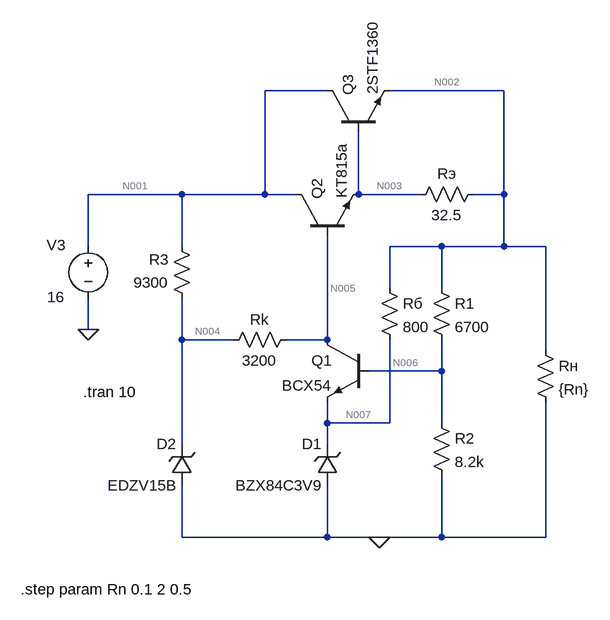
[diagram p0: schematic Компенсационный стабилизатор.asc]
Компенсационный стабилизатор.asc, the LTspice schematic file:
Version 4
SHEET 1 1044 680
WIRE 416 -128 320 -128
WIRE 688 -128 512 -128
WIRE 192 32 48 32
WIRE 320 32 320 -128
WIRE 320 32 192 32
WIRE 368 32 320 32
WIRE 464 32 464 -64
WIRE 560 32 464 32
WIRE 688 32 688 -128
WIRE 688 32 640 32
WIRE 48 112 48 32
WIRE 192 112 192 32
WIRE 592 112 512 112
WIRE 688 112 688 32
WIRE 688 112 592 112
WIRE 752 112 688 112
WIRE 512 176 512 112
WIRE 592 176 592 112
WIRE 48 240 48 192
WIRE 192 256 192 192
WIRE 272 256 192 256
WIRE 416 256 416 96
WIRE 416 256 352 256
WIRE 752 272 752 112
WIRE 592 304 592 256
WIRE 592 304 480 304
WIRE 416 384 416 352
WIRE 512 384 512 256
WIRE 512 384 416 384
WIRE 592 384 592 304
WIRE 192 416 192 256
WIRE 416 416 416 384
WIRE 192 560 192 480
WIRE 416 560 416 480
WIRE 416 560 192 560
WIRE 496 560 416 560
WIRE 592 560 592 464
WIRE 592 560 496 560
WIRE 752 560 752 352
WIRE 752 560 592 560
FLAG 496 560 0
FLAG 48 240 0
SYMBOL zener 432 480 R180
WINDOW 0 24 64 Left 2
WINDOW 3 24 0 Left 2
SYMATTR InstName D1
SYMATTR Value BZX84C3V9
SYMATTR Description Diode
SYMATTR Type diode
SYMBOL voltage 48 96 R0
WINDOW 0 -64 14 Left 2
WINDOW 3 -63 94 Left 2
WINDOW 123 0 0 Left 0
WINDOW 39 0 0 Left 0
SYMATTR InstName V3
SYMATTR Value 16
SYMBOL npn 368 96 R270
WINDOW 3 58 70 Left 2
SYMATTR Value KT815a
SYMATTR InstName Q2
SYMBOL npn 416 -64 R270
WINDOW 3 58 70 Left 2
SYMATTR Value 2STF1360
SYMATTR InstName Q3
SYMBOL res 544 48 R270
WINDOW 0 32 56 VTop 2
WINDOW 3 0 56 VBottom 2
SYMATTR InstName Rэ
SYMATTR Value 32.5
SYMBOL res 208 208 R180
WINDOW 0 36 76 Left 2
WINDOW 3 36 40 Left 2
SYMATTR InstName R3
SYMATTR Value 9300
SYMBOL res 256 272 R270
WINDOW 0 32 56 VTop 2
WINDOW 3 0 56 VBottom 2
SYMATTR InstName Rk
SYMATTR Value 3200
SYMBOL npn 480 256 M0
WINDOW 3 58 70 Left 2
SYMATTR Value BCX54
SYMATTR InstName Q1
SYMBOL res 496 160 R0
SYMATTR InstName Rб
SYMATTR Value 800
SYMBOL res 576 160 R0
SYMATTR InstName R1
SYMATTR Value 6700
SYMBOL res 736 256 R0
SYMATTR InstName Rн
SYMATTR Value {Rn}
SYMBOL res 576 368 R0
SYMATTR InstName R2
SYMATTR Value 8.2k
SYMBOL zener 208 480 R180
WINDOW 0 24 64 Left 2
WINDOW 3 24 0 Left 2
SYMATTR InstName D2
SYMATTR Value EDZV15B
SYMATTR Description Diode
SYMATTR Type diode
TEXT 40 336 Left 2 !.tran 10
TEXT -56 640 Left 2 !.step param Rn 0.1 2 0.5

The netlist it stands for:
* Компенсационный стабилизатор.asc
D1 0 N007 BZX84C3V9
V3 N001 0 16
Q2 N001 N005 N003 0 KT815a
Q3 N001 N003 N002 0 2STF1360
Rэ N003 N002 32.5
R3 N004 N001 9300
Rk N004 N005 3200
Q1 N005 N006 N007 0 BCX54
Rб N002 N007 800
R1 N002 N006 6700
Rн N002 0 {Rn}
R2 N006 0 8.2k
D2 0 N004 EDZV15B
.model D D
.lib standard.dio
.model NPN NPN
.model PNP PNP
.lib standard.bjt
.tran 10
.step param Rn 0.1 2 0.5
.backanno
.end

* Results of the author's LTspice run, read from the files saved beside the schematic
* Operating Point (first step), zero values left out:
*   rn = 100 m
*   V(n007) = 573.3 mV
*   V(n001) = 16 V
*   V(n005) = 2.28 V
*   V(n003) = 1.498 V
*   V(n002) = 573.3 mV
*   V(n004) = 5.792 V
*   V(n006) = 315.5 mV
*   Ic(Q1) = 2.006 pA
*   Ib(Q1) = -2.264 pA
*   Ic(Q3) = 5.628 A
*   Ib(Q3) = 76.09 mA
*   Ie(Q3) = -5.704 A
*   Ic(Q2) = 103.4 mA
*   Ib(Q2) = 1.098 mA
*   Ie(Q2) = -104.5 mA
*   I(D2) = -23.82 pA
*   I(R2) = 38.48 µA
*   I(Rн) = 5.733 A
*   I(R1) = 38.48 µA
*   I(Rб) = 1.017 pA
*   I(Rk) = 1.098 mA
*   I(R3) = -1.098 mA
*   I(Rэ) = 28.44 mA
*   I(V3) = -5.733 A
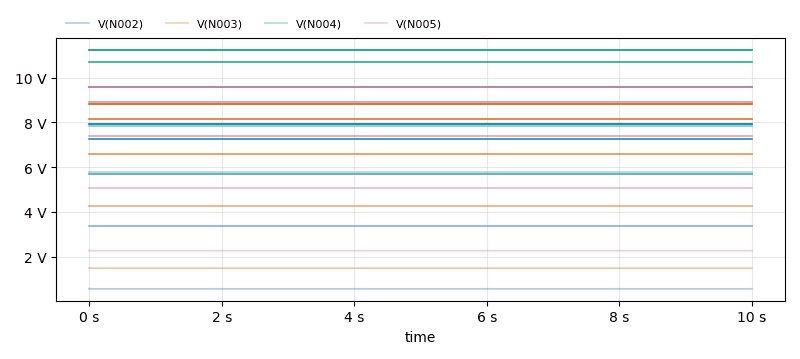
[diagram p1: Transient Analysis of Компенсационный стабилизатор.asc, plotted from the saved traces]
* Transient Analysis, 5 runs:
*   V(N002) [rn=0.1]: min 565.3 mV, max 573.3 mV, average 565.3 mV, rms 565.3 mV, last 565.4 mV
*   V(N002) [rn=0.6]: min 3.363 V, max 3.363 V, average 3.363 V, rms 3.363 V, last 3.363 V
*   V(N002) [rn=1.1]: min 5.71 V, max 5.71 V, average 5.71 V, rms 5.71 V, last 5.71 V
*   V(N002) [rn=1.6]: min 7.242 V, max 7.242 V, average 7.242 V, rms 7.242 V, last 7.242 V
*   V(N002) [rn=2]: min 7.94 V, max 7.94 V, average 7.94 V, rms 7.94 V, last 7.94 V
*   V(N003) [rn=0.1]: min 1.488 V, max 1.498 V, average 1.488 V, rms 1.488 V, last 1.488 V
*   V(N003) [rn=0.6]: min 4.278 V, max 4.278 V, average 4.278 V, rms 4.278 V, last 4.278 V
*   V(N003) [rn=1.1]: min 6.614 V, max 6.614 V, average 6.614 V, rms 6.614 V, last 6.614 V
*   V(N003) [rn=1.6]: min 8.135 V, max 8.135 V, average 8.135 V, rms 8.135 V, last 8.135 V
*   V(N003) [rn=2]: min 8.825 V, max 8.825 V, average 8.825 V, rms 8.825 V, last 8.825 V
*   V(N004) [rn=0.1]: min 5.785 V, max 5.792 V, average 5.785 V, rms 5.785 V, last 5.785 V
*   V(N004) [rn=0.6]: min 7.855 V, max 7.855 V, average 7.855 V, rms 7.855 V, last 7.855 V
*   V(N004) [rn=1.1]: min 9.586 V, max 9.586 V, average 9.586 V, rms 9.586 V, last 9.586 V
*   V(N004) [rn=1.6]: min 10.71 V, max 10.71 V, average 10.71 V, rms 10.71 V, last 10.71 V
*   V(N004) [rn=2]: min 11.22 V, max 11.22 V, average 11.22 V, rms 11.22 V, last 11.22 V
*   V(N005) [rn=0.1]: min 2.27 V, max 2.28 V, average 2.27 V, rms 2.27 V, last 2.27 V
*   V(N005) [rn=0.6]: min 5.052 V, max 5.052 V, average 5.052 V, rms 5.052 V, last 5.052 V
*   V(N005) [rn=1.1]: min 7.38 V, max 7.38 V, average 7.38 V, rms 7.38 V, last 7.38 V
*   V(N005) [rn=1.6]: min 8.894 V, max 8.894 V, average 8.894 V, rms 8.894 V, last 8.894 V
*   V(N005) [rn=2]: min 9.581 V, max 9.581 V, average 9.581 V, rms 9.581 V, last 9.581 V